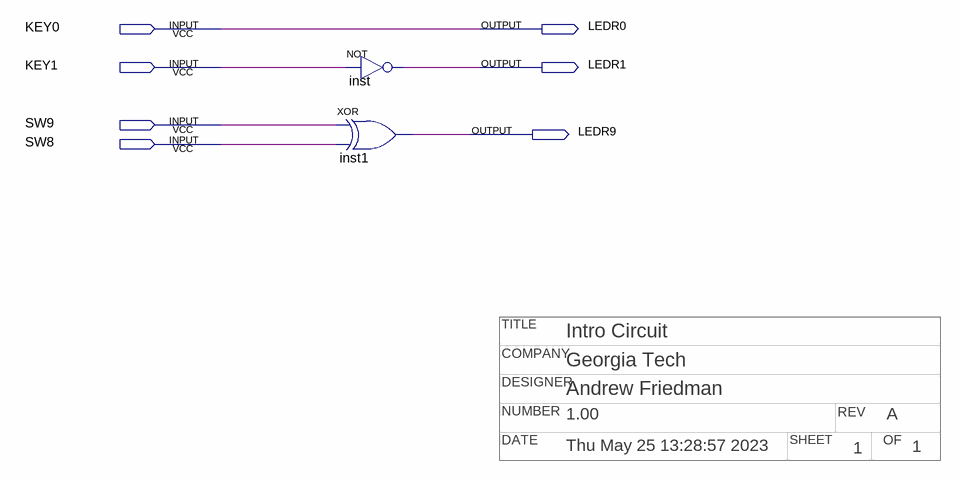
[diagram p0: schematic sheet]
// Quartus schematic IntroCircuit.bdf as structural Verilog: 2 symbols, 7 pins
// Title block: COMPANY: Georgia Tech; DATE: Thu May 25 13:28:57 2023; DESIGNER: Andrew Friedman; NUMBER: 1.00; OF: 1; REV: A; SHEET: 1; TITLE: Intro Circuit
module IntroCircuit (
  input  KEY0,
  input  KEY1,
  input  SW9,
  input  SW8,
  output LEDR0,
  output LEDR1,
  output LEDR9
);

  not inst (LEDR1, KEY1);
  xor inst1 (LEDR9, SW9, SW8);

  assign LEDR0 = KEY0;
endmodule
